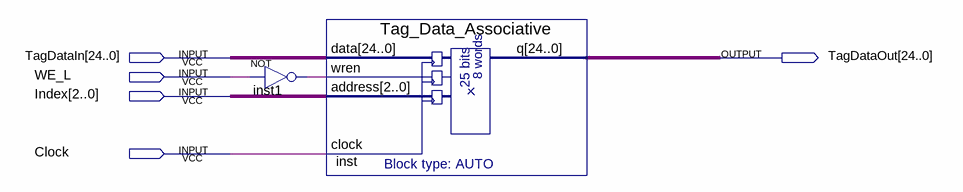
[diagram p0: schematic sheet]
// Quartus schematic TagData_Associative.bdf as structural Verilog: 2 symbols, 5 pins
module TagData_Associative (
  input  [24:0] TagDataIn,
  input  WE_L,
  input  [2:0] Index,
  input  Clock,
  output [24:0] TagDataOut
);

  wire inst1_out;

  not inst1 (inst1_out, WE_L);
  Tag_Data_Associative inst (.data(TagDataIn), .wren(inst1_out), .address(Index), .clock(Clock), .q(TagDataOut));
endmodule
